# EAGLE design power mux-v12 (EAGLE 6.5.0)
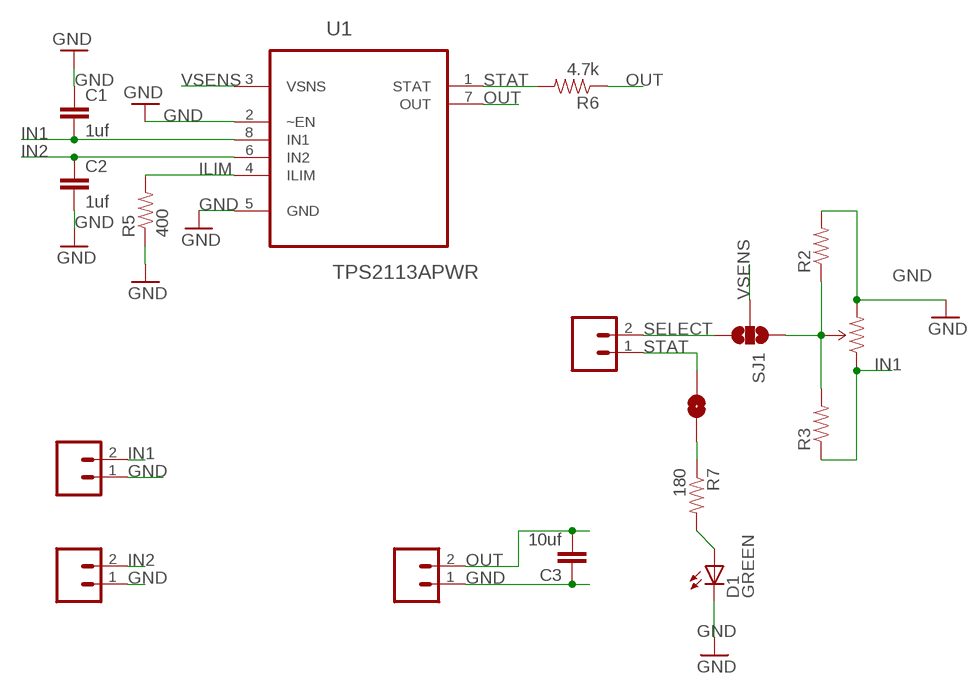
[diagram p0: schematic, sheet 1]

## Parts
C1  1uf  CAP0603-CAP  [0603-CAP]
C2  1uf  CAP0603-CAP  [0603-CAP]
C3  10uf  CAP0603-CAP  [0603-CAP]
D1  GREEN  LED-GREEN0603  [LED-0603]
JP3  M021X02_NO_SILK  [1X02_NO_SILK]
JP4  M021X02_NO_SILK  [1X02_NO_SILK]
JP5  M021X02_NO_SILK  [1X02_NO_SILK]
JP6  M021X02_NO_SILK  [1X02_NO_SILK]
R1  TRIMPOT-PTH-KNOB  [3386U]
R2  RESISTOR0603  [0603-RES]
R3  RESISTOR0603  [0603-RES]
R5  400  RESISTOR0603-RES  [0603-RES]
R6  4.7k  RESISTOR0603-RES  [0603-RES]
R7  180  RESISTOR0603-RES  [0603-RES]
SJ1  SOLDERJUMPER_2WAYPASTE1&2  [SJ_3_PASTE1&2]
SJ2  SOLDERJUMPERNC2  [SJ_2S-NOTRACE]
U1  TPS2113APWR  [SOP65P640X120-8N]

## Nets
GND: C1.1 C2.2 C3.1 D1.C JP3.1 JP4.1 JP6.1 R1.3(CW) R2.2 R5.1 U1.2(~EN) U1.5(GND)
ILIM: R5.2 U1.4(ILIM)
IN1: C1.2 JP3.2 R1.1(CCW) R3.1 U1.8(IN1)
IN2: C2.1 JP4.2 U1.6(IN2)
N$1: D1.A R7.2
N$2: R1.2(WIPER) R2.1 R3.2 SJ1.1
N$3: R7.1 SJ2.1
OUT: C3.2 JP6.2 R6.1 U1.7(OUT)
SELECT: JP5.2 SJ1.3
STAT: JP5.1 R6.2 SJ2.2 U1.1(STAT)
VSENS: SJ1.2 U1.3(VSNS)

## Library data of the parts
C1 C2 = SparkFun-Passives:CAP: Capacitor Standard 0603 ceramic capacitor, and 0.1" leaded capacitor.
C3 = SparkFun-Capacitors:CAP: Capacitor Standard 0603 ceramic capacitor, and 0.1" leaded capacitor.
D1 = SparkFun-LED:LED-GREEN: Various green LEDs 0603- DIO-00821 LARGE- DIO-00862 LILYPAD- DIO-09910; PROD_ID: DIO-00821
JP3-JP6 = SparkFun-Connectors:M02: Standard 2-pin 0.1" header. Use with - straight break away headers ( PRT-00116) - right angle break away headers (PRT-00553) - swiss pins (PRT-00743) - machine pins (PRT-00117) - female headers (PRT-00115) Molex polarized connector foot print use with: PRT-08233 with associated crimp pins and housings. 2.54_SCREWTERM for use with PRT-10571. 3.5mm Screw Terminal footprints for PRT-08084 5mm Screw Terminal footprints for use with PRT-08433
R1 = SparkFun-Electromechanical:TRIMPOT: Various small potentiometers for "set-and-forget" applications
R2 R3 = SparkFun-Resistors:RESISTOR: Resistor Basic schematic elements and footprints for 0603, 1206, and PTH resistors.
R5-R7 = SparkFun-Passives:RESISTOR: Resistor Basic schematic elements and footprints for 0603, 1206, and PTH resistors.
SJ1 = SparkFun-Passives:SOLDERJUMPER_2WAY: Solder Jumper 2 way solder jumper
SJ2 = SparkFun-Passives:SOLDERJUMPER: Solder Jumper Standard SMD solder jumper. Used to automate production. Two varients : Normally Open and Normally Closed are the same, but have different paste layers. NC will have a large amount of paste and should jumper during reflow.
U1 = Texas Instruments_By_element14_Batch_1:TPS2113APWR: AUTOSWITCHING POWER MUX; MPN: TPS2113APWR; OC_FARNELL: 1757288; OC_NEWARK: 01J0961; PACKAGE: TSSOP-8; SUPPLIER: TEXAS INSTRUMENTS

## Board
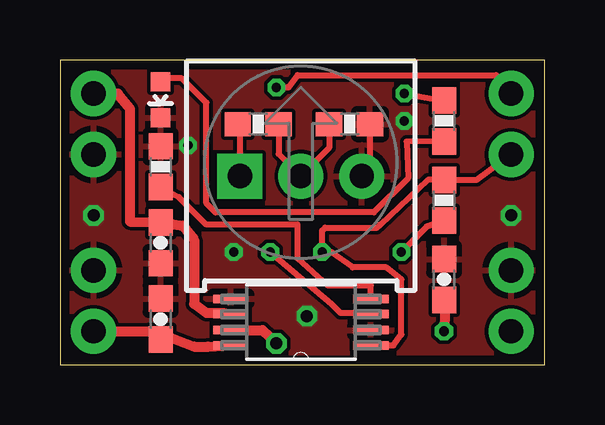
[diagram p1: board, top side]
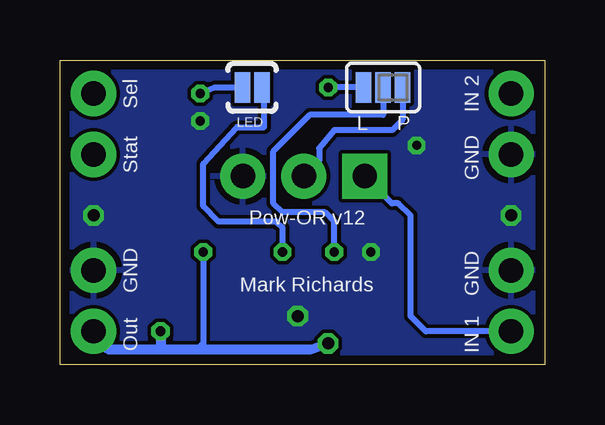
[diagram p2: board, bottom side, seen from below]

Size 20.19 x 12.7 mm. Coordinates in mm from the lower left corner, seen from the top.
Outline: 0,0 20.19,0 20.19,12.7 0,12.7 0,0
Copper layers (1*16): Top 0.0356mm / dielectric 1.5011mm / Bottom 0.0356mm
Design rules "LaenPCBOrder": minimum track width 6mil, minimum drill 13mil, track to track 6mil, track to pad 6mil, pad to pad 6mil, via to via 6mil, smd to smd 6mil, copper to edge 15mil, drill to drill 6mil, minimum pad ring 7mil, minimum via ring 7mil, stop-mask expansion 3mil, vias tented up to drill 0mil, thermal gap 10mil

### Footprints (pad centres in the part's own frame; a part is rotated, then mirrored left to right if it is on the bottom)
0603-CAP = smd 1.1 x 1: 1 -0.85,0; 2 0.85,0
LED-0603 = smd 0.8 x 0.8: A 0,-0.75; C 0,0.75
1X02_NO_SILK = drill 1.016 pad 1.88: 1 0,0; 2 2.54,0
3386U = drill 1.016 pad 1.88 square: 1 -2.54,-0.015 | drill 1.016 pad 1.88: 2 0,-0.015; 3 2.54,-0.015
0603-RES = smd 1.1 x 1: 1 -0.85,0; 2 0.85,0
SJ_3_PASTE1&2 = smd 0.635 x 1.27: 1 -0.813,0; 2 0,0; 3 0.813,0
SJ_2S-NOTRACE = smd 0.635 x 1.27: 1 -0.401,0; 2 0.413,0
SOP65P640X120-8N = smd 1.473 x 0.356: 1 -2.921,0.965; 2 -2.921,0.33; 3 -2.921,-0.33; 4 -2.921,-0.965; 5 2.921,-0.965; 6 2.921,-0.33; 7 2.921,0.33; 8 2.921,0.965

### Placement (x,y rotation side)
C1  4.19,1.91 270 top
C2  4.19,5.08 270 top
C3  16,3.56 270 top
D1  4.19,11.05 180 top
JP3  1.4,3.94 270 top
JP4  1.4,8.76 90 top
JP5  18.8,8.76 90 top
JP6  18.8,3.94 270 top
R1  10.03,7.87 0 top
R2  12.06,10.03 0 top
R3  8.26,10.03 0 top
R5  4.19,8.26 270 top
R6  16,6.86 90 top
R7  16,10.16 270 top
SJ1  6.73,11.56 180 bottom
SJ2  12.19,11.56 0 bottom
U1  10.03,1.78 180 top

### Tracks (layer width: path | path; a pad name or v marks a point on that pad's centre or on a via)
GND  (via drill 0.38, 0.5)
  Top 0.254: R2.2 12.91,8.2 R1.3
  other vias: 7.24,4.7 1.4,6.22 10.29,2.03 18.8,6.22 5.33,9.14 14.35,10.16
  pour Bottom: 0,12.7 20.19,12.7 20.19,0 0,0
  pour Top: 0,12.7 20.19,12.7 20.19,0 0,0
ILIM
  Top 0.254: U1.4 12.95,3.3 11.18,3.3 9.91,4.45 9.91,5.84 6.1,5.84 4.95,6.99 4.23,7.37 R5.2
IN1
  Top 0.254: R3.1 7.49,10.03 R1.1
  Top 0.406: U1.8 6.17,0.76 5.59,0.76 3.94,1.4 3.81,1.4 | JP3.2 3.81,1.4 | 3.81,1.4 C1.2
  Bottom 0.254: JP3.2 4.95,1.4 5.59,2.03 5.59,6.22 6.1,6.73 6.37,6.73 R1.1
IN2
  Top 0.406: U1.6 6.81,2.16 6.1,2.16 5.59,2.54 5.59,5.21 5.12,5.8 C2.1 2.92,5.97 2.92,10.67 2.41,11.3 JP4.2
N$1
  Top 0.254: R7.2 14.44,9.3 14.51,7.77 13.08,6.35 6.48,6.35 6.1,6.73 6.1,10.92 5.08,11.94 4.2,11.94 D1.A
N$2
  Top 0.254: R3.2 9.11,8.79 R1.2 11.21,9.04 R2.1
  Bottom 0.254: SJ1.1 5.92,10.21 6.35,9.78 8.76,9.78 9.4,9.02 9.4,8.49 R1.2
N$3  (via drill 0.38)
  Top 0.254: v14.35,11.3 R7.1
  Bottom 0.254: v14.35,11.3 13.74,11.56 SJ2.1
OUT  (via drill 0.38, 0.41, 0.5)
  Top 0.254: R6.1 15.28,5.75 v14.22,4.7
  Top 0.406: U1.7 8.43,1.45 v9.02,0.89 | C3.2 16.04,2.2 v16,1.4
  Bottom 0.254: 16.13,0.76 16.26,0.64 | v14.22,4.7 14.22,0.89 14.48,0.64
  Bottom 0.406: v9.02,0.89 9.78,0.64 14.48,0.64 16,0.64 | 16,0.64 16.26,0.64 18.16,0.64 JP6.2 | v16,1.4 16,0.64
SELECT  (via drill 0.38)
  Top 0.254: 18.41,11.56 JP5.2 18.16,12.06 9.91,12.06 9.53,11.56 v9.02,11.56
  Bottom 0.254: SJ1.3 v9.02,11.56
STAT  (via drill 0.38)
  Top 0.254: U1.1 13.89,0.81 14.22,1.27 14.22,3.56 13.59,4.06 12.19,4.06 11.3,4.7 v10.92,4.7 10.92,5.59 11.05,5.71 13.21,5.71 13.34,5.84 15.33,7.71 R6.2 17.36,7.71 JP5.1
  Bottom 0.254: SJ2.2 11.68,11.4 11.68,9.91 12.83,9.91 14.22,8.38 14.22,6.6 13.59,5.97 11.18,5.97 10.92,5.71 v10.92,4.7
VSENS  (via drill 0.38)
  Top 0.254: v8.76,4.7 11.3,2.54 11.68,2.16 13.03,2.16 U1.3
  Bottom 0.254: SJ1.2 6.73,10.41 9.78,10.41 11.3,8.89 11.3,6.73 10.92,6.35 9.14,6.35 8.76,5.97 v8.76,4.7

### Text on the board
bPlace: IN 2 | Sel | P | L | LED | GND | Stat | Pow-OR v12 | GND | GND | Mark Richards | IN 1 | Out